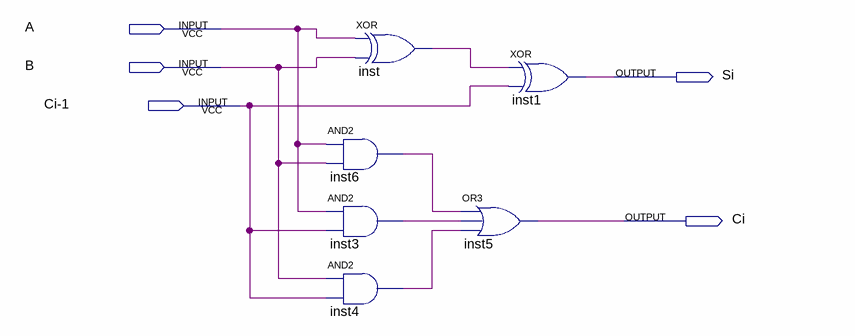
[diagram p0: schematic sheet]
// Quartus schematic FA.bdf as structural Verilog: 6 symbols, 5 pins
module FA (
  input  A,
  input  B,
  input  \Ci-1 ,
  output Si,
  output Ci
);

  wire inst3_out, inst4_out, inst6_out, inst_out;

  and inst6 (inst6_out, A, B);
  and inst3 (inst3_out, A, \Ci-1 );
  and inst4 (inst4_out, B, \Ci-1 );
  xor inst (inst_out, A, B);
  or inst5 (Ci, inst6_out, inst3_out, inst4_out);
  xor inst1 (Si, inst_out, \Ci-1 );
endmodule
